# EAGLE schematic 1 (EAGLE 9.6.2)
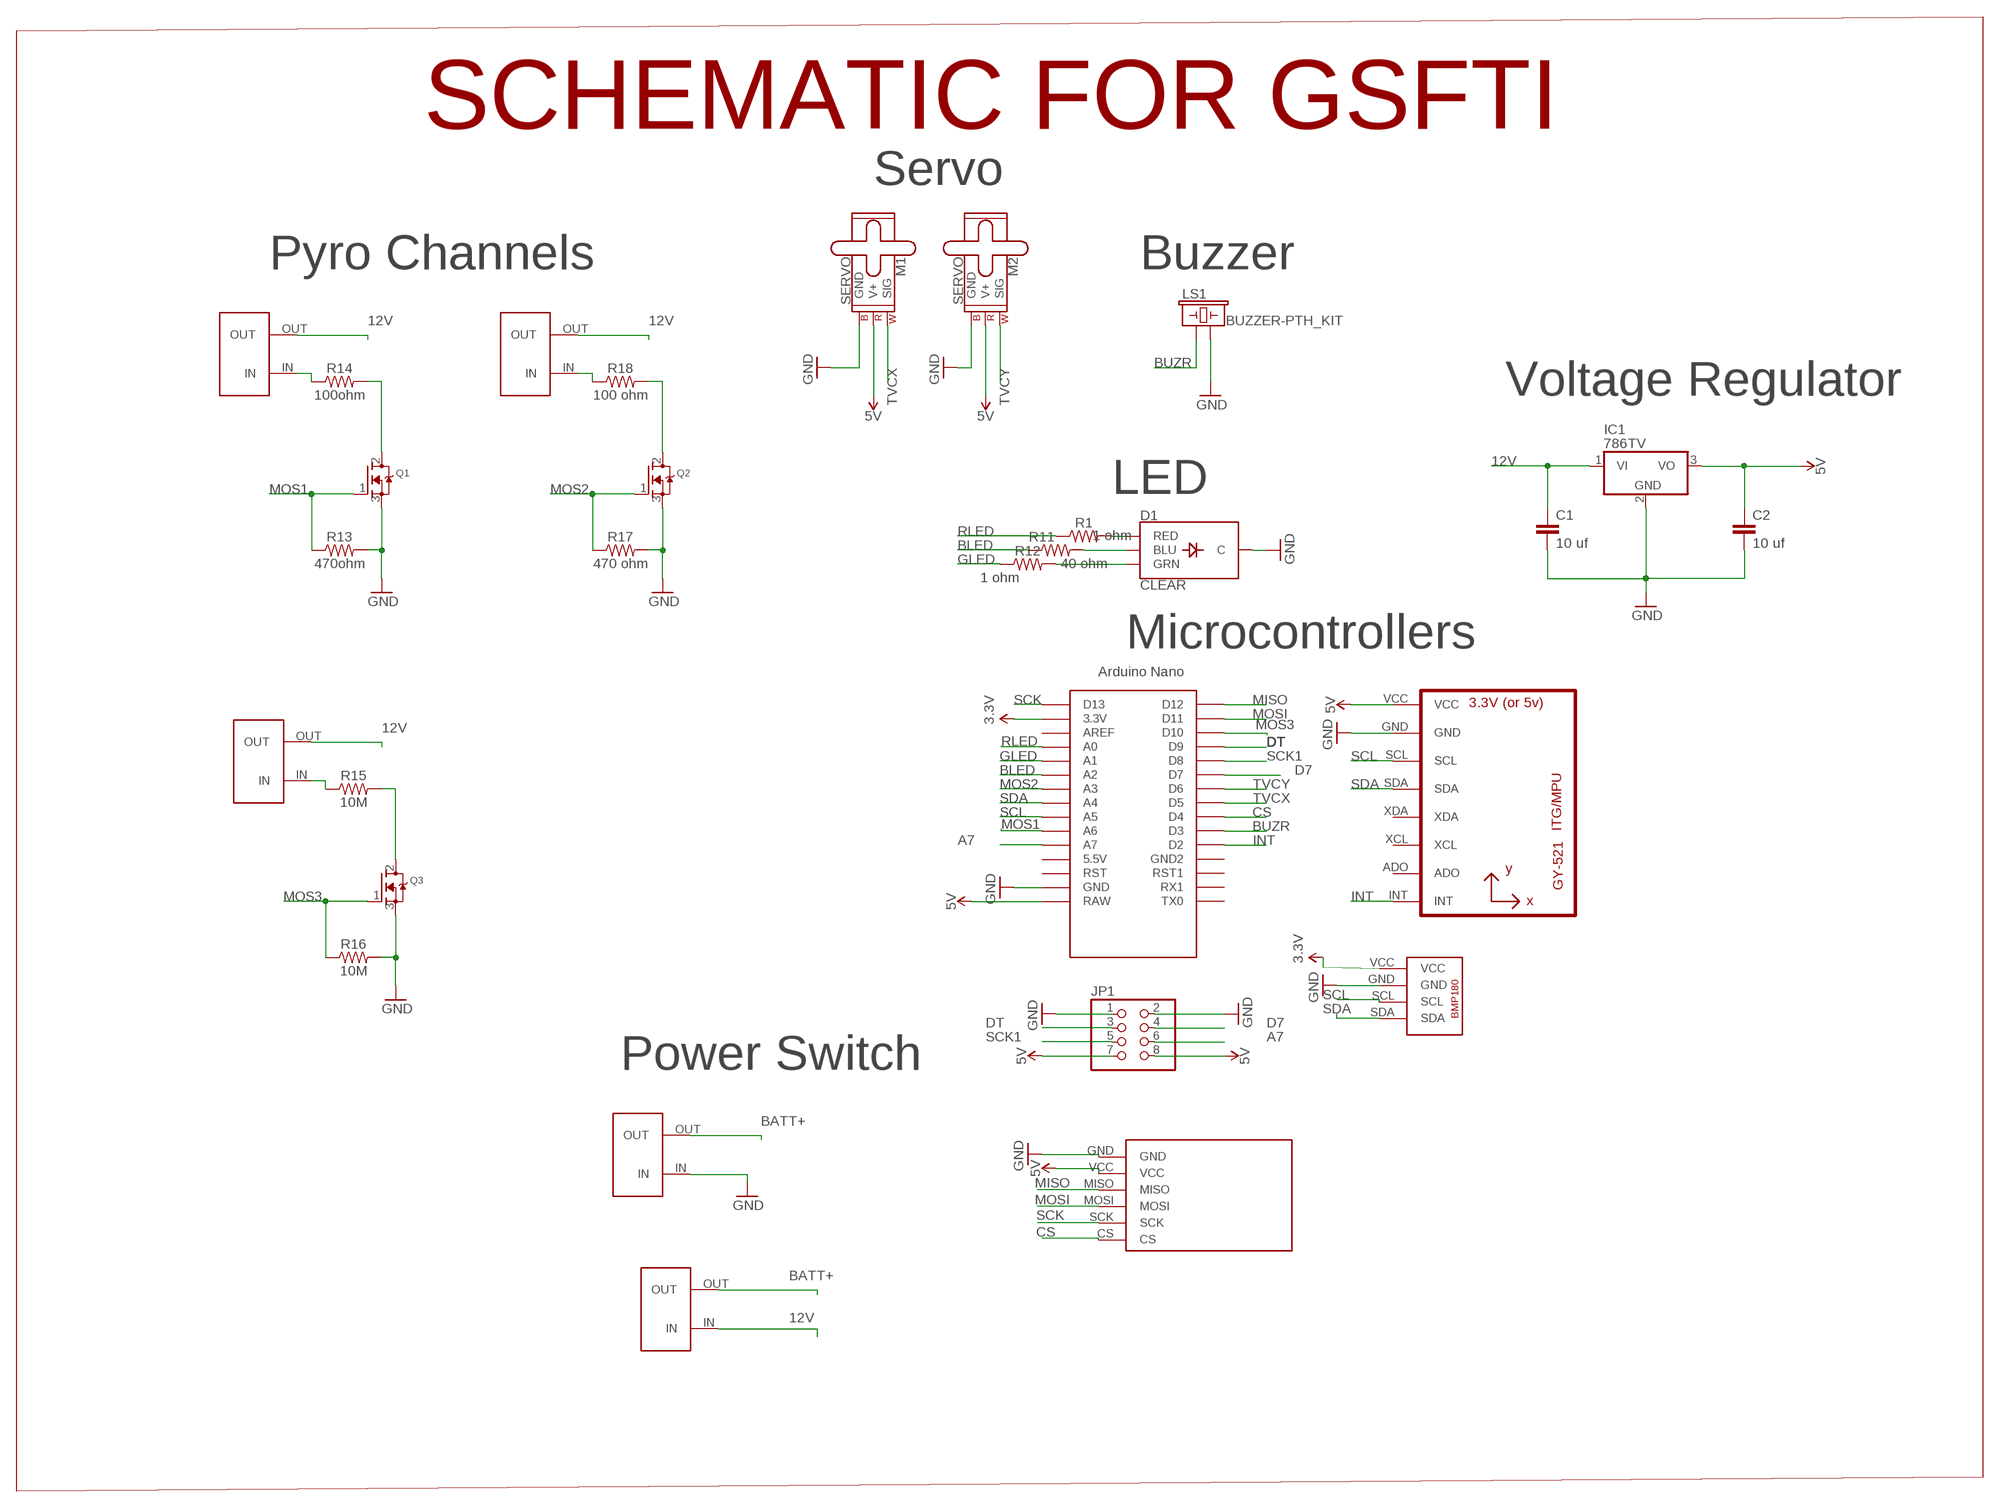
[diagram p0: schematic, sheet 1]

## Parts
C1  10 uf  C2,5-3  [C2.5-3]
C2  10 uf  C2,5-3  [C2.5-3]
D1  CLEAR  LED-RGB-CCCLEAR  [LED-RGB-THRU]
IC1  786TV  [TO220V]
JP1  PINHD-2X4  [2X04]
LS1  BUZZER-PTH_KIT  [BUZZER-12MM-KIT]
M1  SERVO  [1X03]
M2  SERVO  [1X03]
Q1  MOSFET-NGDS_TO220V  [TO220V]
Q2  MOSFET-NGDS_TO220V  [TO220V]
Q3  MOSFET-NGDS_TO220V  [TO220V]
R1  1 ohm  10MOHM-HORIZ-1/4W-5%  [AXIAL-0.3]
R11  40 ohm  10MOHM-HORIZ-1/4W-5%  [AXIAL-0.3]
R12  1 ohm  10MOHM-HORIZ-1/4W-5%  [AXIAL-0.3]
R13  470ohm  10MOHM-HORIZ-1/4W-5%  [AXIAL-0.3]
R14  100ohm  10MOHM-HORIZ-1/4W-5%  [AXIAL-0.3]
R15  10M  10MOHM-HORIZ-1/4W-5%  [AXIAL-0.3]
R16  10M  10MOHM-HORIZ-1/4W-5%  [AXIAL-0.3]
R17  470 ohm  10MOHM-HORIZ-1/4W-5%  [AXIAL-0.3]
R18  100 ohm  10MOHM-HORIZ-1/4W-5%  [AXIAL-0.3]
U1  GY-521MPU6050  [GY-521]
U$1  NANO  [NANO]
U$2  BMP180  [BMP180]
U$3  SD  [SD]
U$4  TERMINALBLOCKS  [TERMINALBLOCKS]
U$7  TERMINALBLOCKS  [TERMINALBLOCKS]
U$8  TERMINALBLOCKS  [TERMINALBLOCKS]
U$9  TERMINALBLOCKS  [TERMINALBLOCKS]
U$10  TERMINALBLOCKS  [TERMINALBLOCKS]

## Nets
3.3V: U$1.3.3V U$2.VCC
5V: C2.1 IC1.3(VO) JP1.7 JP1.8 M1.2(V+) M2.2(V+) U1.VCC U$1.RAW U$3.VCC
12V: C1.1 IC1.1(VI) U$7.IN U$8.OUT U$9.OUT U$10.OUT
A7: JP1.6 U$1.A7
BATT+: U$4.OUT U$7.OUT
BLED: R11.P$1 U$1.A2
BUZR: LS1.+ U$1.D3
CS: U$1.D4 U$3.CS
D7: JP1.4 U$1.D7
DT: JP1.3 U$1.D9
GLED: R12.P$1 U$1.A1
GND: C1.2 C2.2 D1.2(C) IC1.2(GND) JP1.1 JP1.2 LS1.- M1.3(GND) M2.3(GND) Q1.3(S) Q2.3(S) Q3.3(S) R13.P$2 R16.P$2 R17.P$2 U1.GND U$1.GND U$2.GND U$3.GND U$4.IN
INT: U1.INT U$1.D2
MISO: U$1.D12 U$3.MISO
MOS1: Q1.1(G) R13.P$1 U$1.A6
MOS2: Q2.1(G) R17.P$1 U$1.A3
MOS3: Q3.1(G) R16.P$1 U$1.D10
MOSI: U$1.D11 U$3.MOSI
N$2: D1.1(RED) R1.P$2
N$3: D1.4(BLU) R11.P$2
N$4: D1.3(GRN) R12.P$2
N$5: Q2.2(D) R18.P$2
N$6: R18.P$1 U$9.IN
N$7: Q1.2(D) R14.P$2
N$8: R14.P$1 U$8.IN
N$9: Q3.2(D) R15.P$2
N$10: R15.P$1 U$10.IN
RLED: R1.P$1 U$1.A0
SCK: U$1.D13 U$3.SCK
SCK1: JP1.5 U$1.D8
SCL: U1.SCL U$1.A5 U$2.SCL
SDA: U1.SDA U$1.A4 U$2.SDA
TVCX: M1.1(SIG) U$1.D5
TVCY: M2.1(SIG) U$1.D6
Unconnected: U1.ADO U1.XCL U1.XDA U$1.5V(5.5V) U$1.AREF U$1.GND1(GND2) U$1.ICSP1 U$1.ICSP2 U$1.ICSP3 U$1.ICSP4 U$1.ICSP5 U$1.ICSP6 U$1.RST U$1.RST1 U$1.RX1 U$1.TX0

## Notes on the sheet
- SCHEMATIC FOR GSFTI
- Servo
- Pyro Channels | Buzzer
- Voltage Regulator
- LED
- Microcontrollers
- Power Switch

## Library data of the parts
C1 C2 = capacitor-wima:C: CAPACITOR naming: grid - package width
D1 = SparkFun-LED:LED-RGB-CC: LED-RGB Common Cathode Packages: LED RGB-THRU LED_PIRANHA_5MM SparkFun Products: RGB Diffused Common Cathode- Diffuse <[https://www.sparkfun.com/products/9264]> RGB Diffused Common Cathode - Clear <[https://www.sparkfun.com/products/105]> LED-RGB 5mm Square (Piranha) <[https://www.sparkfun.com/products/11679]>; PROD_ID: DIO-08418
IC1 = linear:78*: Positive VOLTAGE REGULATOR Source: http://cache.national.com/ds/LM/LM78L05.pdf http://www.fairchildsemi.com/ds/LM/LM7805.pdf
JP1 = adafruit:PINHD-2X4: PIN HEADER
LS1 = SparkFun-Electromechanical:BUZZER: Buzzer Small round buzzers that operate around the audible 2kHz range. You can use these as speakers to create simple music or user interfaces. Variant Overview: PTH - Mini Speaker - PC Mount 12mm 2.048kHz <https://www.sparkfun.com/products/7950> PTH_KIT - Mini Speaker - PC Mount 12mm 2.048kHz <https://www.sparkfun.com/products/7950> KIT simplifies soldering by adding stop mask to one side of the pads. PTH_NO_SILK - Mini Speaker - PC Mount 12mm 2.048kHz <https://www.sparkfun.com/products/7950> No silkscreen indicator of buzzer outline. PTH_KIT_NO_SILK - Mini Speaker - PC Mount 12mm 2.048kHz <https://www.sparkfun.com/products/7950> KIT package w/o silkscreen SMD - Buzzer Audio Magnetic (CCV-084B16) SMD buzzer used on, e.g. the LilyPad Buzzer <https://www.sparkfun.com/products/8463> and RFID USB Reader <https://www.sparkfun.com/products/9963>. SMD_KIT - Buzzer Audio Magnetic (CCV-084B16) SMD Buzzer with elongated pins to make soldering easier. Used on the SparkFun Simon Says - Surface Mount Soldering Kit <https://www.sparkfun.com/products/10935>. SMD-SQUARE - Buzzer Audio Magnetic (COMP-15701) SMT square buzzer with one chamfered corner.; PROD_ID: COMP-08253; SF_SKU: COM-07950
M1 M2 = SparkFun-Electromechanical:SERVO: Servo Motor 3-pin connector for a standard servo motor (voltage supply, ground, and control signal.) SparkFun Products Servo - Generic (Sub-Micro Size) <https://www.sparkfun.com/products/9065> (ROB-09065) Servo - Generic High Torque Continuous Rotation (Standard Size) <https://www.sparkfun.com/products/9347> (ROB-09347) Servo - Generic High Torque (Standard Size) <https://www.sparkfun.com/products/11965> (ROB-11965)
Q1-Q3 = adafruit:MOSFET-N: N-Channel Mosfet 2N7002E - 60V 260mA SOT23 [Digikey: 2N7002ET1GOSTR-ND] - REEL BSH103 - 30V 850mA SOT23 [Digikey: 568-5013-1-ND]
R1 R11-R14 R17 R18 = SparkFun-Resistors:10MOHM: RES-09327; PROD_ID: RES-09327; VALUE: 10M
R15 R16 = SparkFun-Resistors:10MOHM: RES-09327; PROD_ID: RES-09327
U1 = gy-521:GY-521
U$1 = Arduino-clone:NANO: Arduino Nano
U$2 = BMP180:BMP180
U$3 = SD:SD
U$4 U$7-U$10 = TERMINALBLOCKS:TERMINALBLOCKS